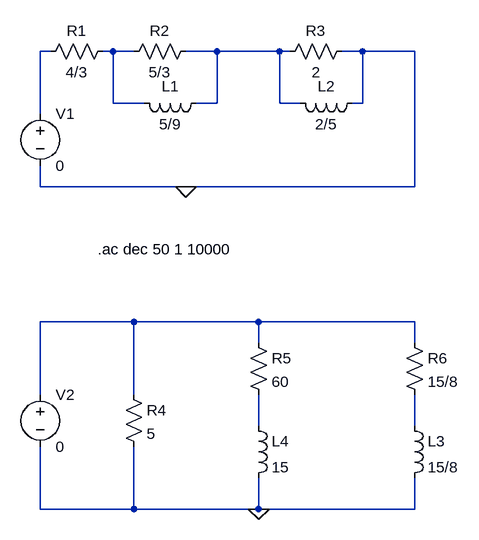
[diagram p0: schematic Lab8_ques3.asc]
Lab8_ques3.asc, the LTspice schematic file:
Version 4
SHEET 1 880 912
WIRE 112 192 96 192
WIRE 208 192 192 192
WIRE 240 192 208 192
WIRE 368 192 320 192
WIRE 464 192 368 192
WIRE 480 192 464 192
WIRE 592 192 560 192
WIRE 672 192 592 192
WIRE 208 272 208 192
WIRE 256 272 208 272
WIRE 368 272 368 192
WIRE 368 272 336 272
WIRE 464 272 464 192
WIRE 496 272 464 272
WIRE 592 272 592 192
WIRE 592 272 576 272
WIRE 96 288 96 192
WIRE 96 400 96 368
WIRE 320 400 96 400
WIRE 672 400 672 192
WIRE 672 400 320 400
WIRE 240 608 96 608
WIRE 432 608 240 608
WIRE 672 608 432 608
WIRE 432 640 432 608
WIRE 672 640 672 608
WIRE 96 720 96 608
WIRE 240 720 240 608
WIRE 432 768 432 720
WIRE 672 768 672 720
WIRE 96 896 96 800
WIRE 240 896 240 800
WIRE 240 896 96 896
WIRE 432 896 432 848
WIRE 432 896 240 896
WIRE 672 896 672 848
WIRE 672 896 432 896
FLAG 320 400 0
FLAG 432 896 0
SYMBOL Res 208 176 R90
WINDOW 0 0 56 VBottom 2
WINDOW 3 32 56 VTop 2
SYMATTR InstName R1
SYMATTR Value 4/3
SYMBOL Res 336 176 R90
WINDOW 0 0 56 VBottom 2
WINDOW 3 32 56 VTop 2
SYMATTR InstName R2
SYMATTR Value 5/3
SYMBOL Res 576 176 R90
WINDOW 0 0 56 VBottom 2
WINDOW 3 32 56 VTop 2
SYMATTR InstName R3
SYMATTR Value 2
SYMBOL Ind 352 256 R90
WINDOW 0 5 56 VBottom 2
WINDOW 3 32 56 VTop 2
SYMATTR InstName L1
SYMATTR Value 5/9
SYMBOL Ind 592 256 R90
WINDOW 0 5 56 VBottom 2
WINDOW 3 32 56 VTop 2
SYMATTR InstName L2
SYMATTR Value 2/5
SYMBOL Voltage 96 272 R0
SYMATTR InstName V1
SYMATTR Value 0
SYMATTR Value2 AC 1
SYMBOL Res 224 704 R0
SYMATTR InstName R4
SYMATTR Value 5
SYMBOL Res 416 624 R0
SYMATTR InstName R5
SYMATTR Value 60
SYMBOL Res 656 624 R0
SYMATTR InstName R6
SYMATTR Value 15/8
SYMBOL Ind 656 752 R0
SYMATTR InstName L3
SYMATTR Value 15/8
SYMBOL Ind 416 752 R0
SYMATTR InstName L4
SYMATTR Value 15
SYMBOL Voltage 96 704 R0
SYMATTR InstName V2
SYMATTR Value 0
SYMATTR Value2 AC 1
TEXT 184 496 Left 2 !.ac dec 50 1 10000

The netlist it stands for:
* Lab8_ques3.asc
R1 N002 N001 4/3
R2 N003 N002 5/3
R3 0 N003 2
L1 N003 N002 5/9
L2 0 N003 2/5
V1 N001 0 0 AC 1
R4 N004 0 5
R5 N004 N005 60
R6 N004 N006 15/8
L3 N006 0 15/8
L4 N005 0 15
V2 N004 0 0 AC 1
.ac dec 50 1 10000
.backanno
.end